# Altium project VOU_SOM_CV_V0.0.1.PrjPcb (part 3 of 3)

## Sheet Conn_B.SchDoc
size A1
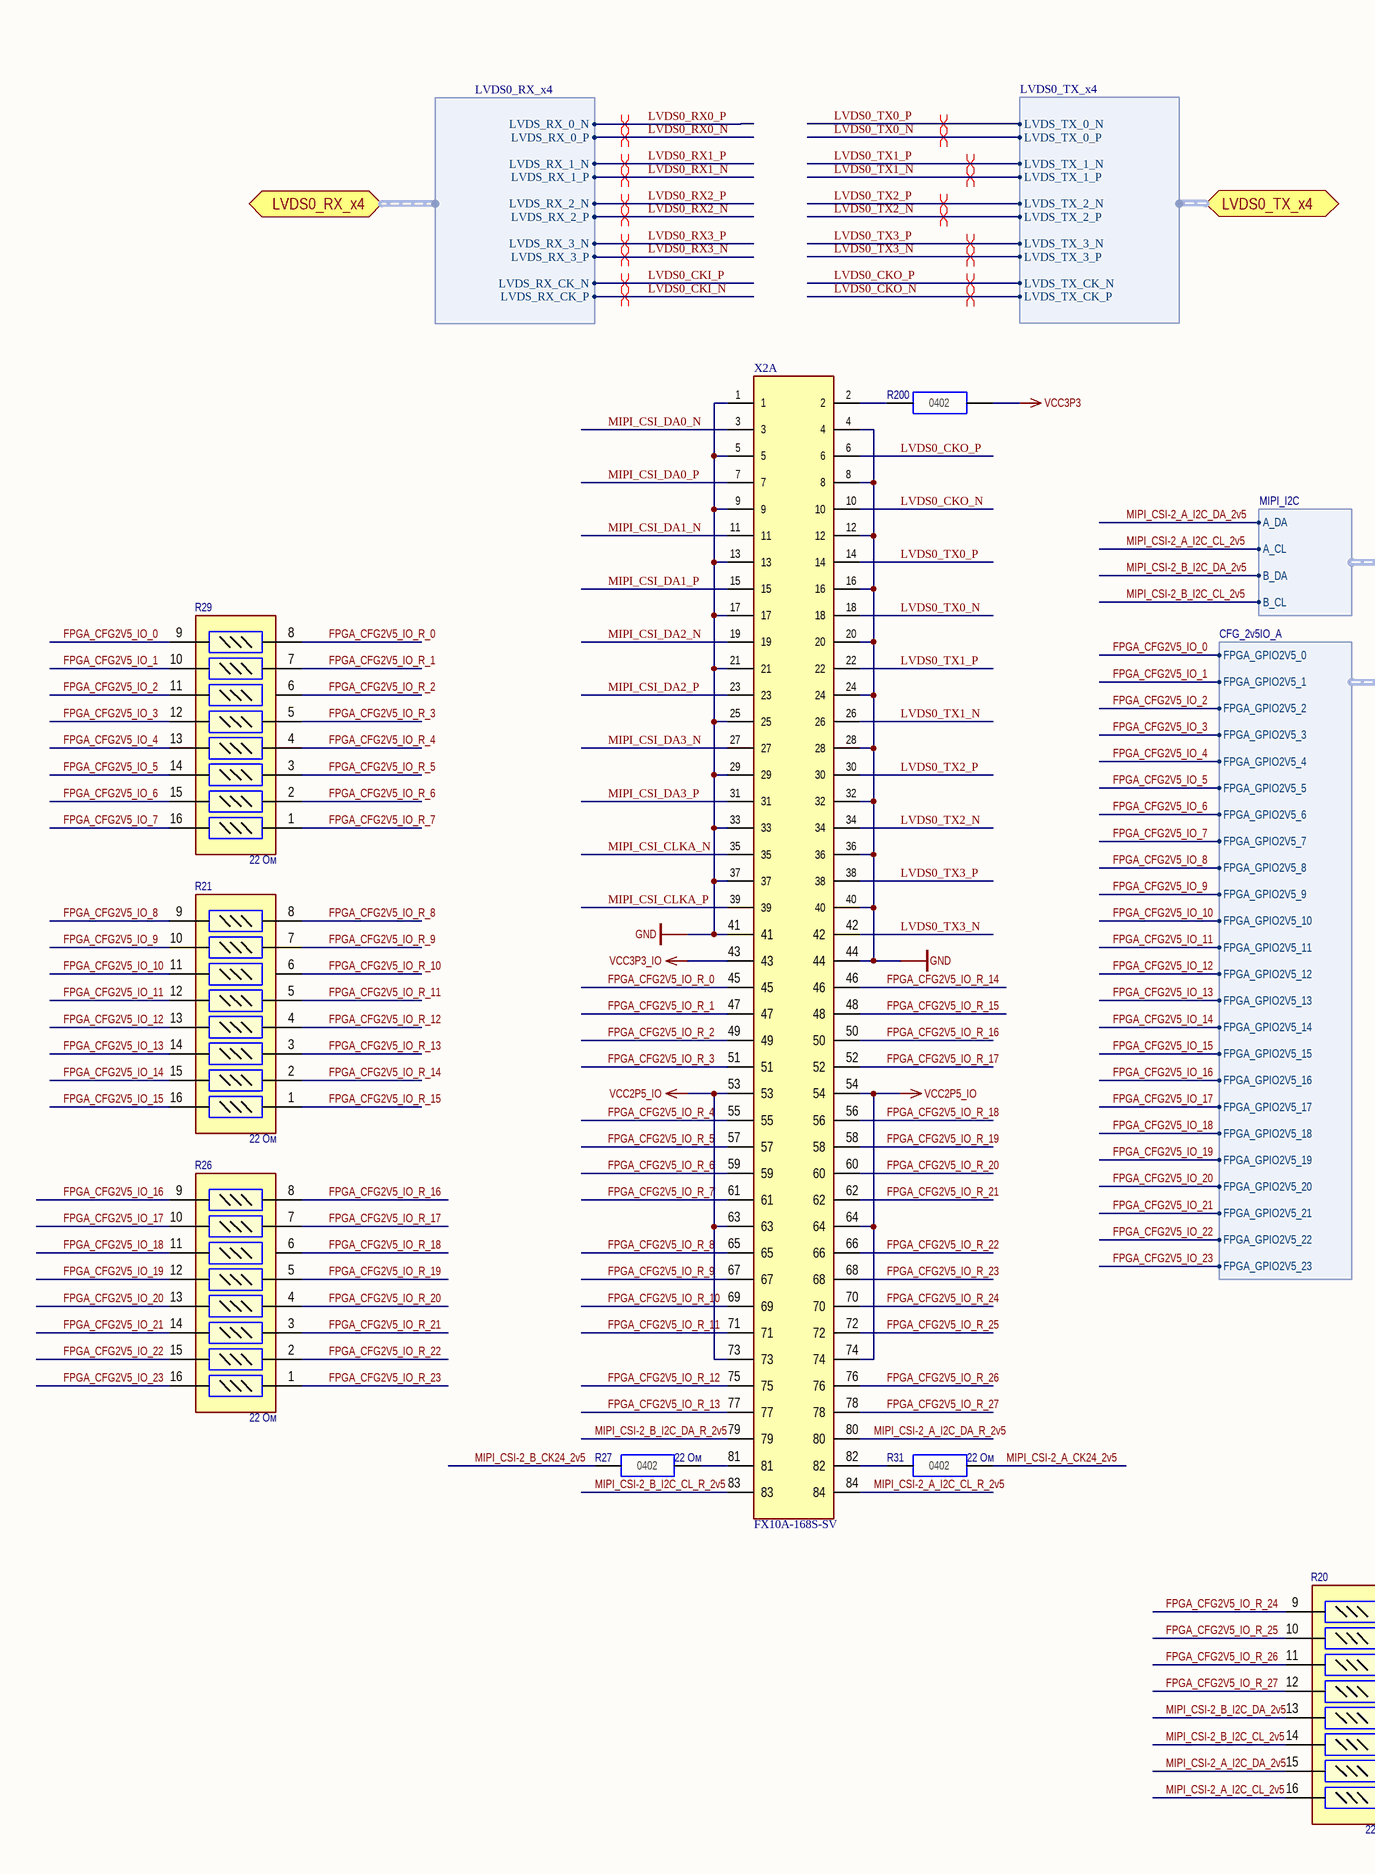
[diagram p15: Conn_B.SchDoc, left]
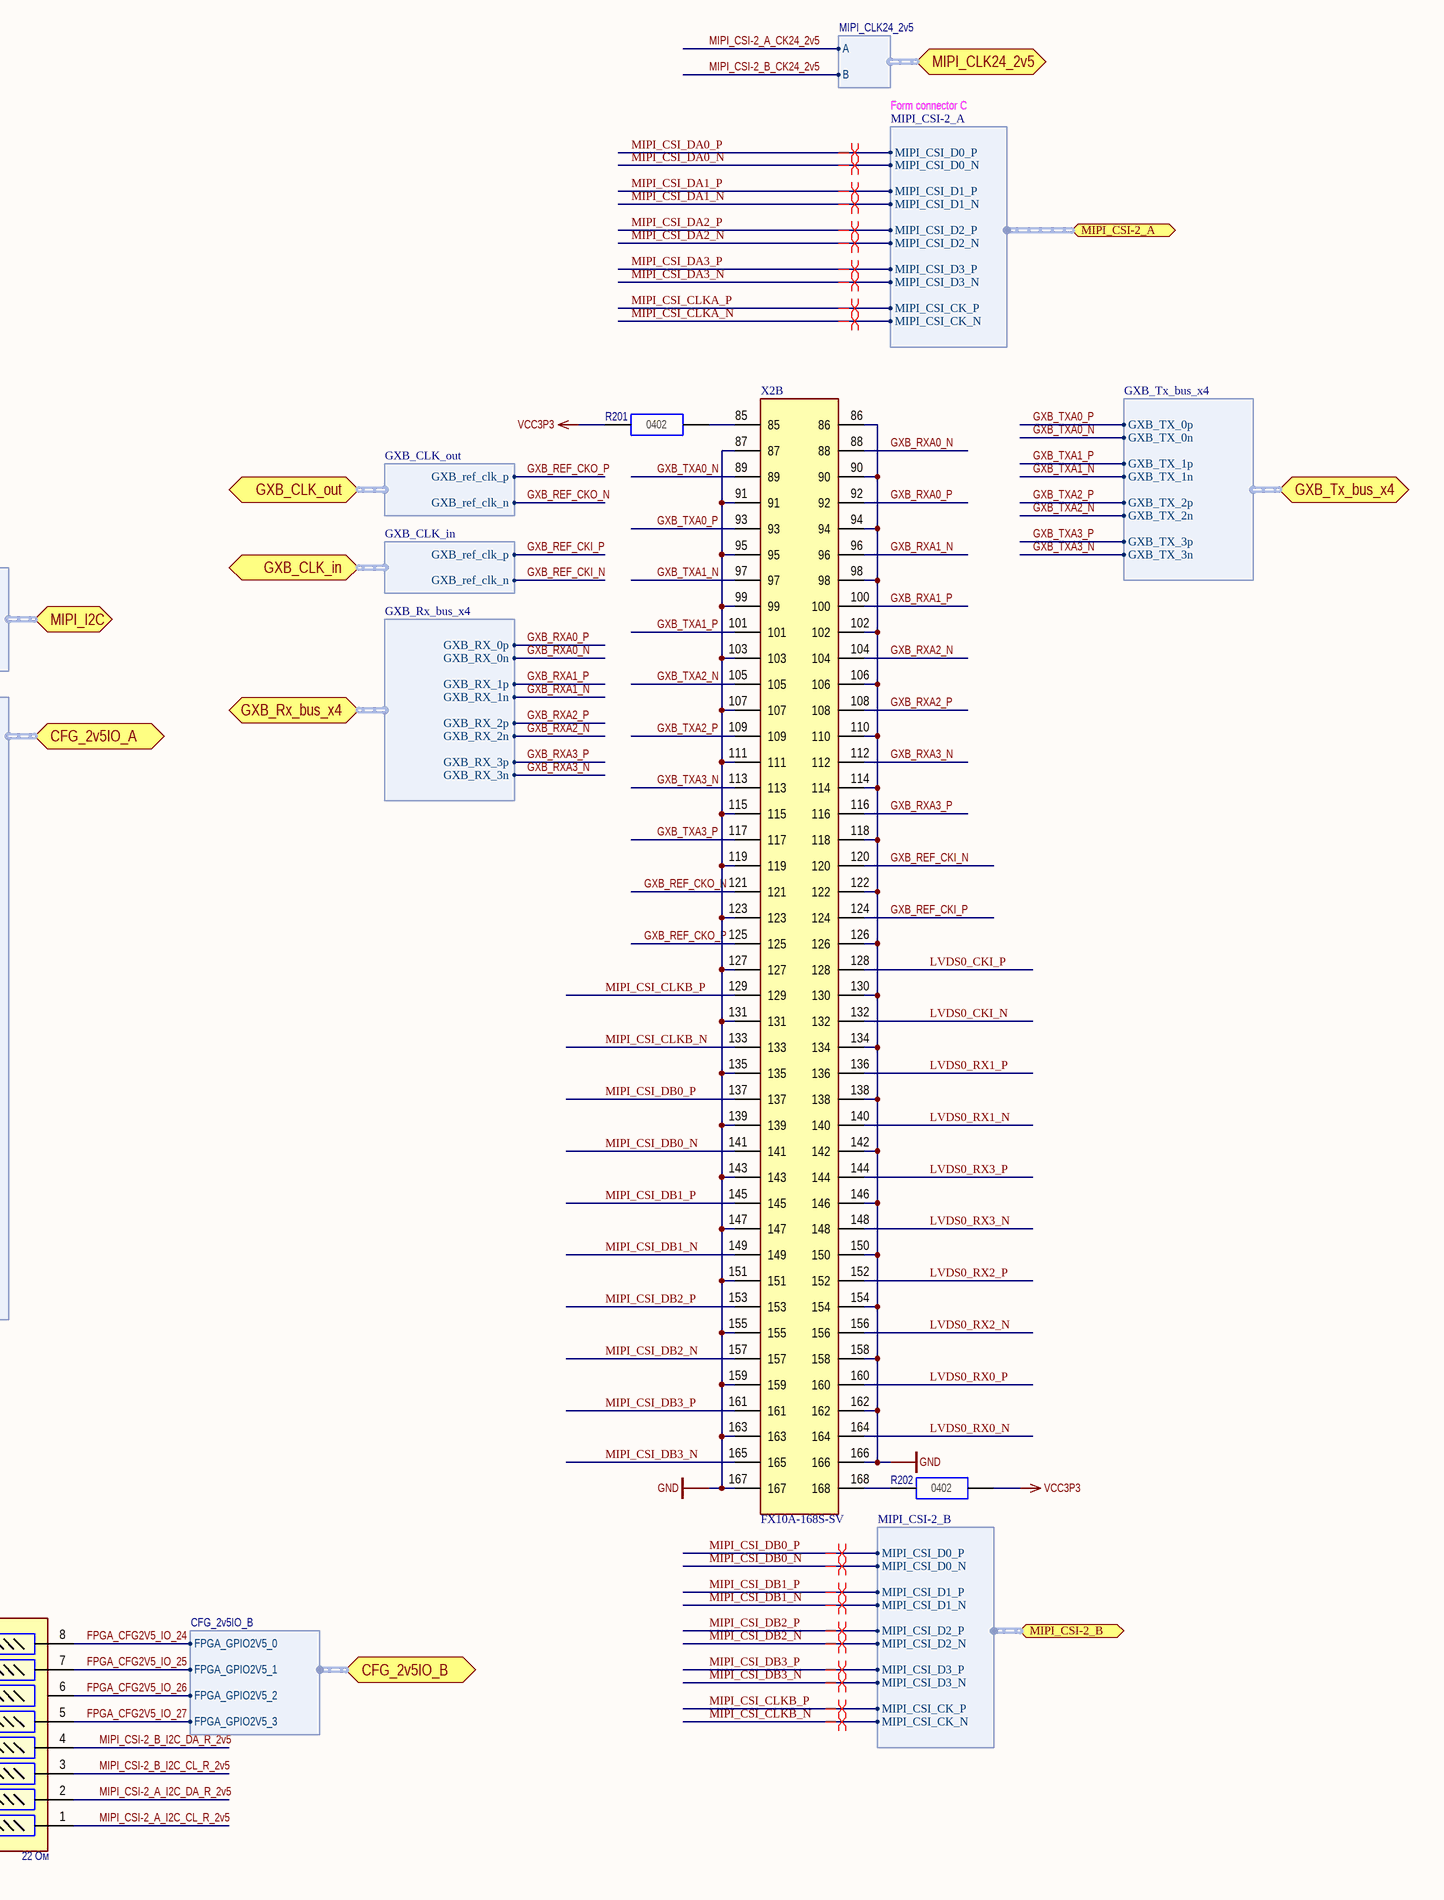
[diagram p16: Conn_B.SchDoc, right]

### Parts
R20  value 22 Ом  [YC248]  (hidden comment: YC248-JR-07-22 Ом)
R21  value 22 Ом  [YC248]  (hidden comment: YC248-JR-07-22 Ом)
R26  value 22 Ом  [YC248]  (hidden comment: YC248-JR-07-22 Ом)
R27  value 22 Ом  [CR0402(1005)]  (hidden comment: CR0402-22 Ом-±5%)
R29  value 22 Ом  [YC248]  (hidden comment: YC248-JR-07-22 Ом)
R31  value 22 Ом  [CR0402(1005)]  (hidden comment: CR0402-22 Ом-±5%)
R200  CR0402-0 Ом-±5%  [CR0402(1005)]  (value not drawn)
R201  CR0402-0 Ом-±5%  [CR0402(1005)]  (value not drawn)
R202  CR0402-0 Ом-±5%  [CR0402(1005)]  (value not drawn)
X2  FX10A-168S-SV  [FX10A-168S-SV]  (parts A,B of 2)

### Ports
CFG_2v5IO_A (harness CFG_2v5IO_A), CFG_2v5IO_B (harness CFG_2v5IO_B), GXB_CLK_in (harness GXB_CLK_in), GXB_CLK_out (harness GXB_CLK_out), GXB_Rx_bus_x4 (harness GXB_Rx_bus_x4), GXB_Tx_bus_x4 (harness GXB_Tx_bus_x4), LVDS0_RX_x4 (harness LVDS0_RX_x4), LVDS0_TX_x4 (harness LVDS0_TX_x4), MIPI_CLK24_2v5 (harness MIPI_CLK24_2v5), MIPI_CSI-2_A (harness MIPI_CSI-2_A), MIPI_CSI-2_B (harness MIPI_CSI-2_B), MIPI_I2C (harness MIPI_I2C)

### Harnesses
MIPI_CSI-2_A: MIPI_CSI_D0_N, MIPI_CSI_D0_P, MIPI_CSI_D1_N, MIPI_CSI_D1_P, MIPI_CSI_D2_P, MIPI_CSI_D2_N, MIPI_CSI_D3_N, MIPI_CSI_D3_P, MIPI_CSI_CK_N, MIPI_CSI_CK_P
MIPI_CSI-2_B: MIPI_CSI_D0_N, MIPI_CSI_D0_P, MIPI_CSI_D1_N, MIPI_CSI_D1_P, MIPI_CSI_D2_P, MIPI_CSI_D2_N, MIPI_CSI_D3_N, MIPI_CSI_D3_P, MIPI_CSI_CK_N, MIPI_CSI_CK_P
MIPI_CLK24_2v5: A, B
MIPI_I2C: A_DA, A_CL, B_DA, B_CL
CFG_2v5IO_A: FPGA_GPIO2V5_0, FPGA_GPIO2V5_1, FPGA_GPIO2V5_2, FPGA_GPIO2V5_3, FPGA_GPIO2V5_4, FPGA_GPIO2V5_5, FPGA_GPIO2V5_6, FPGA_GPIO2V5_7, FPGA_GPIO2V5_8, FPGA_GPIO2V5_9, FPGA_GPIO2V5_10, FPGA_GPIO2V5_11, FPGA_GPIO2V5_12, FPGA_GPIO2V5_13, FPGA_GPIO2V5_14, FPGA_GPIO2V5_15, FPGA_GPIO2V5_16, FPGA_GPIO2V5_17, FPGA_GPIO2V5_18, FPGA_GPIO2V5_19, FPGA_GPIO2V5_20, FPGA_GPIO2V5_21, FPGA_GPIO2V5_22, FPGA_GPIO2V5_23
CFG_2v5IO_B: FPGA_GPIO2V5_0, FPGA_GPIO2V5_1, FPGA_GPIO2V5_2, FPGA_GPIO2V5_3
GXB_Rx_bus_x4: GXB_RX_0p, GXB_RX_0n, GXB_RX_1p, GXB_RX_1n, GXB_RX_2p, GXB_RX_2n, GXB_RX_3p, GXB_RX_3n
GXB_Tx_bus_x4: GXB_TX_0p, GXB_TX_0n, GXB_TX_1p, GXB_TX_1n, GXB_TX_2p, GXB_TX_2n, GXB_TX_3p, GXB_TX_3n
GXB_CLK_out: GXB_ref_clk_p, GXB_ref_clk_n
GXB_CLK_in: GXB_ref_clk_p, GXB_ref_clk_n
LVDS0_TX_x4: LVDS_TX_0_P, LVDS_TX_0_N, LVDS_TX_1_P, LVDS_TX_1_N, LVDS_TX_2_P, LVDS_TX_2_N, LVDS_TX_3_P, LVDS_TX_3_N, LVDS_TX_CK_P, LVDS_TX_CK_N
LVDS0_RX_x4: LVDS_RX_0_P, LVDS_RX_0_N, LVDS_RX_1_P, LVDS_RX_1_N, LVDS_RX_2_P, LVDS_RX_2_N, LVDS_RX_3_P, LVDS_RX_3_N, LVDS_RX_CK_P, LVDS_RX_CK_N

### Nets
GND: X2.1 X2.4 X2.5 X2.8 X2.9 X2.12 X2.13 X2.16 X2.17 X2.20 X2.21 X2.24 X2.25 X2.28 X2.29 X2.32 X2.33 X2.36 X2.37 X2.40 X2.41 X2.44 X2.86 X2.87 X2.90 X2.91 X2.94 X2.95 X2.98 X2.99 X2.102 X2.103 X2.106 X2.107 X2.110 X2.111 X2.114 X2.115 X2.118 X2.119 X2.122 X2.123 X2.126 X2.127 X2.130 X2.131 X2.134 X2.135 X2.138 X2.139 X2.142 X2.143 X2.146 X2.147 X2.150 X2.151 X2.154 X2.155 X2.158 X2.159 X2.162 X2.163 X2.166 X2.167
VCC2P5_IO: X2.53 X2.54 X2.63 X2.64 X2.73 X2.74
VCC3P3: R200.2(-) R201.1(+) R202.2(-)
VCC3P3_IO: X2.43
FPGA_CFG2V5_IO_0: R29.9 ; port CFG_2v5IO_A.FPGA_GPIO2V5_0
FPGA_CFG2V5_IO_1: R29.10 ; port CFG_2v5IO_A.FPGA_GPIO2V5_1
FPGA_CFG2V5_IO_2: R29.11 ; port CFG_2v5IO_A.FPGA_GPIO2V5_2
FPGA_CFG2V5_IO_3: R29.12 ; port CFG_2v5IO_A.FPGA_GPIO2V5_3
FPGA_CFG2V5_IO_4: R29.13 ; port CFG_2v5IO_A.FPGA_GPIO2V5_4
FPGA_CFG2V5_IO_5: R29.14 ; port CFG_2v5IO_A.FPGA_GPIO2V5_5
FPGA_CFG2V5_IO_6: R29.15 ; port CFG_2v5IO_A.FPGA_GPIO2V5_6
FPGA_CFG2V5_IO_7: R29.16 ; port CFG_2v5IO_A.FPGA_GPIO2V5_7
FPGA_CFG2V5_IO_8: R21.9 ; port CFG_2v5IO_A.FPGA_GPIO2V5_8
FPGA_CFG2V5_IO_9: R21.10 ; port CFG_2v5IO_A.FPGA_GPIO2V5_9
FPGA_CFG2V5_IO_10: R21.11 ; port CFG_2v5IO_A.FPGA_GPIO2V5_10
FPGA_CFG2V5_IO_11: R21.12 ; port CFG_2v5IO_A.FPGA_GPIO2V5_11
FPGA_CFG2V5_IO_12: R21.13 ; port CFG_2v5IO_A.FPGA_GPIO2V5_12
FPGA_CFG2V5_IO_13: R21.14 ; port CFG_2v5IO_A.FPGA_GPIO2V5_13
FPGA_CFG2V5_IO_14: R21.15 ; port CFG_2v5IO_A.FPGA_GPIO2V5_14
FPGA_CFG2V5_IO_15: R21.16 ; port CFG_2v5IO_A.FPGA_GPIO2V5_15
FPGA_CFG2V5_IO_16: R26.9 ; port CFG_2v5IO_A.FPGA_GPIO2V5_16
FPGA_CFG2V5_IO_17: R26.10 ; port CFG_2v5IO_A.FPGA_GPIO2V5_17
FPGA_CFG2V5_IO_18: R26.11 ; port CFG_2v5IO_A.FPGA_GPIO2V5_18
FPGA_CFG2V5_IO_19: R26.12 ; port CFG_2v5IO_A.FPGA_GPIO2V5_19
FPGA_CFG2V5_IO_20: R26.13 ; port CFG_2v5IO_A.FPGA_GPIO2V5_20
FPGA_CFG2V5_IO_21: R26.14 ; port CFG_2v5IO_A.FPGA_GPIO2V5_21
FPGA_CFG2V5_IO_22: R26.15 ; port CFG_2v5IO_A.FPGA_GPIO2V5_22
FPGA_CFG2V5_IO_23: R26.16 ; port CFG_2v5IO_A.FPGA_GPIO2V5_23
FPGA_CFG2V5_IO_24: R20.8 ; port CFG_2v5IO_B.FPGA_GPIO2V5_0
FPGA_CFG2V5_IO_25: R20.7 ; port CFG_2v5IO_B.FPGA_GPIO2V5_1
FPGA_CFG2V5_IO_26: R20.6 ; port CFG_2v5IO_B.FPGA_GPIO2V5_2
FPGA_CFG2V5_IO_27: R20.5 ; port CFG_2v5IO_B.FPGA_GPIO2V5_3
FPGA_CFG2V5_IO_R_0: R29.8 X2.45
FPGA_CFG2V5_IO_R_1: R29.7 X2.47
FPGA_CFG2V5_IO_R_2: R29.6 X2.49
FPGA_CFG2V5_IO_R_3: R29.5 X2.51
FPGA_CFG2V5_IO_R_4: R29.4 X2.55
FPGA_CFG2V5_IO_R_5: R29.3 X2.57
FPGA_CFG2V5_IO_R_6: R29.2 X2.59
FPGA_CFG2V5_IO_R_7: R29.1 X2.61
FPGA_CFG2V5_IO_R_8: R21.8 X2.65
FPGA_CFG2V5_IO_R_9: R21.7 X2.67
FPGA_CFG2V5_IO_R_10: R21.6 X2.69
FPGA_CFG2V5_IO_R_11: R21.5 X2.71
FPGA_CFG2V5_IO_R_12: R21.4 X2.75
FPGA_CFG2V5_IO_R_13: R21.3 X2.77
FPGA_CFG2V5_IO_R_14: R21.2 X2.46
FPGA_CFG2V5_IO_R_15: R21.1 X2.48
FPGA_CFG2V5_IO_R_16: R26.8 X2.50
FPGA_CFG2V5_IO_R_17: R26.7 X2.52
FPGA_CFG2V5_IO_R_18: R26.6 X2.56
FPGA_CFG2V5_IO_R_19: R26.5 X2.58
FPGA_CFG2V5_IO_R_20: R26.4 X2.60
FPGA_CFG2V5_IO_R_21: R26.3 X2.62
FPGA_CFG2V5_IO_R_22: R26.2 X2.66
FPGA_CFG2V5_IO_R_23: R26.1 X2.68
FPGA_CFG2V5_IO_R_24: R20.9 X2.70
FPGA_CFG2V5_IO_R_25: R20.10 X2.72
FPGA_CFG2V5_IO_R_26: R20.11 X2.76
FPGA_CFG2V5_IO_R_27: R20.12 X2.78
GXB_REF_CKI_N: X2.120 ; port GXB_CLK_in.GXB_ref_clk_n
GXB_REF_CKI_P: X2.124 ; port GXB_CLK_in.GXB_ref_clk_p
GXB_REF_CKO_N: X2.121 ; port GXB_CLK_out.GXB_ref_clk_n
GXB_REF_CKO_P: X2.125 ; port GXB_CLK_out.GXB_ref_clk_p
GXB_RXA0_N: X2.88 ; port GXB_Rx_bus_x4.GXB_RX_0n
GXB_RXA0_P: X2.92 ; port GXB_Rx_bus_x4.GXB_RX_0p
GXB_RXA1_N: X2.96 ; port GXB_Rx_bus_x4.GXB_RX_1n
GXB_RXA1_P: X2.100 ; port GXB_Rx_bus_x4.GXB_RX_1p
GXB_RXA2_N: X2.104 ; port GXB_Rx_bus_x4.GXB_RX_2n
GXB_RXA2_P: X2.108 ; port GXB_Rx_bus_x4.GXB_RX_2p
GXB_RXA3_N: X2.112 ; port GXB_Rx_bus_x4.GXB_RX_3n
GXB_RXA3_P: X2.116 ; port GXB_Rx_bus_x4.GXB_RX_3p
GXB_TXA0_N: X2.89 ; port GXB_Tx_bus_x4.GXB_TX_0n
GXB_TXA0_P: X2.93 ; port GXB_Tx_bus_x4.GXB_TX_0p
GXB_TXA1_N: X2.97 ; port GXB_Tx_bus_x4.GXB_TX_1n
GXB_TXA1_P: X2.101 ; port GXB_Tx_bus_x4.GXB_TX_1p
GXB_TXA2_N: X2.105 ; port GXB_Tx_bus_x4.GXB_TX_2n
GXB_TXA2_P: X2.109 ; port GXB_Tx_bus_x4.GXB_TX_2p
GXB_TXA3_N: X2.113 ; port GXB_Tx_bus_x4.GXB_TX_3n
GXB_TXA3_P: X2.117 ; port GXB_Tx_bus_x4.GXB_TX_3p
LVDS0_CKI_N: X2.132 ; port LVDS0_RX_x4.LVDS_RX_CK_P
LVDS0_CKI_P: X2.128 ; port LVDS0_RX_x4.LVDS_RX_CK_N
LVDS0_CKO_N: X2.10 ; port LVDS0_TX_x4.LVDS_TX_CK_P
LVDS0_CKO_P: X2.6 ; port LVDS0_TX_x4.LVDS_TX_CK_N
LVDS0_RX0_N: X2.164 ; port LVDS0_RX_x4.LVDS_RX_0_P
LVDS0_RX0_P: X2.160 ; port LVDS0_RX_x4.LVDS_RX_0_N
LVDS0_RX1_N: X2.140 ; port LVDS0_RX_x4.LVDS_RX_1_P
LVDS0_RX1_P: X2.136 ; port LVDS0_RX_x4.LVDS_RX_1_N
LVDS0_RX2_N: X2.156 ; port LVDS0_RX_x4.LVDS_RX_2_P
LVDS0_RX2_P: X2.152 ; port LVDS0_RX_x4.LVDS_RX_2_N
LVDS0_RX3_N: X2.148 ; port LVDS0_RX_x4.LVDS_RX_3_P
LVDS0_RX3_P: X2.144 ; port LVDS0_RX_x4.LVDS_RX_3_N
LVDS0_TX0_N: X2.18 ; port LVDS0_TX_x4.LVDS_TX_0_P
LVDS0_TX0_P: X2.14 ; port LVDS0_TX_x4.LVDS_TX_0_N
LVDS0_TX1_N: X2.26 ; port LVDS0_TX_x4.LVDS_TX_1_P
LVDS0_TX1_P: X2.22 ; port LVDS0_TX_x4.LVDS_TX_1_N
LVDS0_TX2_N: X2.34 ; port LVDS0_TX_x4.LVDS_TX_2_P
LVDS0_TX2_P: X2.30 ; port LVDS0_TX_x4.LVDS_TX_2_N
LVDS0_TX3_N: X2.42 ; port LVDS0_TX_x4.LVDS_TX_3_P
LVDS0_TX3_P: X2.38 ; port LVDS0_TX_x4.LVDS_TX_3_N
MIPI_CSI-2_A_CK24_2v5: R31.2(-) ; port MIPI_CLK24_2v5.A
MIPI_CSI-2_A_I2C_CL_2v5: R20.16 ; port MIPI_I2C.A_CL
MIPI_CSI-2_A_I2C_CL_R_2v5: R20.1 X2.84
MIPI_CSI-2_A_I2C_DA_2v5: R20.15 ; port MIPI_I2C.A_DA
MIPI_CSI-2_A_I2C_DA_R_2v5: R20.2 X2.80
MIPI_CSI-2_B_CK24_2v5: R27.1(+) ; port MIPI_CLK24_2v5.B
MIPI_CSI-2_B_I2C_CL_2v5: R20.14 ; port MIPI_I2C.B_CL
MIPI_CSI-2_B_I2C_CL_R_2v5: R20.3 X2.83
MIPI_CSI-2_B_I2C_DA_2v5: R20.13 ; port MIPI_I2C.B_DA
MIPI_CSI-2_B_I2C_DA_R_2v5: R20.4 X2.79
MIPI_CSI_CLKA_N: X2.35 ; port MIPI_CSI-2_A.MIPI_CSI_CK_N
MIPI_CSI_CLKA_P: X2.39 ; port MIPI_CSI-2_A.MIPI_CSI_CK_P
MIPI_CSI_CLKB_N: X2.133 ; port MIPI_CSI-2_B.MIPI_CSI_CK_N
MIPI_CSI_CLKB_P: X2.129 ; port MIPI_CSI-2_B.MIPI_CSI_CK_P
MIPI_CSI_DA0_N: X2.3 ; port MIPI_CSI-2_A.MIPI_CSI_D0_N
MIPI_CSI_DA0_P: X2.7 ; port MIPI_CSI-2_A.MIPI_CSI_D0_P
MIPI_CSI_DA1_N: X2.11 ; port MIPI_CSI-2_A.MIPI_CSI_D1_N
MIPI_CSI_DA1_P: X2.15 ; port MIPI_CSI-2_A.MIPI_CSI_D1_P
MIPI_CSI_DA2_N: X2.19 ; port MIPI_CSI-2_A.MIPI_CSI_D2_N
MIPI_CSI_DA2_P: X2.23 ; port MIPI_CSI-2_A.MIPI_CSI_D2_P
MIPI_CSI_DA3_N: X2.27 ; port MIPI_CSI-2_A.MIPI_CSI_D3_N
MIPI_CSI_DA3_P: X2.31 ; port MIPI_CSI-2_A.MIPI_CSI_D3_P
MIPI_CSI_DB0_N: X2.141 ; port MIPI_CSI-2_B.MIPI_CSI_D0_N
MIPI_CSI_DB0_P: X2.137 ; port MIPI_CSI-2_B.MIPI_CSI_D0_P
MIPI_CSI_DB1_N: X2.149 ; port MIPI_CSI-2_B.MIPI_CSI_D1_N
MIPI_CSI_DB1_P: X2.145 ; port MIPI_CSI-2_B.MIPI_CSI_D1_P
MIPI_CSI_DB2_N: X2.157 ; port MIPI_CSI-2_B.MIPI_CSI_D2_N
MIPI_CSI_DB2_P: X2.153 ; port MIPI_CSI-2_B.MIPI_CSI_D2_P
MIPI_CSI_DB3_N: X2.165 ; port MIPI_CSI-2_B.MIPI_CSI_D3_N
MIPI_CSI_DB3_P: X2.161 ; port MIPI_CSI-2_B.MIPI_CSI_D3_P
NetR27_2: R27.2(-) X2.81
NetR31_1: R31.1(+) X2.82
NetR200_1: R200.1(+) X2.2
NetR201_2: R201.2(-) X2.85
NetR202_1: R202.1(+) X2.168

### Layout directives
differential pair: LVDS0_CKI_N, LVDS0_CKI_P, LVDS0_CKO_N, LVDS0_CKO_P, LVDS0_RX0_N, LVDS0_RX0_P, LVDS0_RX1_N, LVDS0_RX1_P, LVDS0_RX2_N, LVDS0_RX2_P, LVDS0_RX3_N, LVDS0_RX3_P, LVDS0_TX0_N, LVDS0_TX0_P, LVDS0_TX1_N, LVDS0_TX1_P, LVDS0_TX2_N, LVDS0_TX2_P, LVDS0_TX3_N, LVDS0_TX3_P, MIPI_CSI_CLKA_N, MIPI_CSI_CLKA_P, MIPI_CSI_CLKB_N, MIPI_CSI_CLKB_P, MIPI_CSI_DA0_N, MIPI_CSI_DA0_P, MIPI_CSI_DA1_N, MIPI_CSI_DA1_P, MIPI_CSI_DA2_N, MIPI_CSI_DA2_P, MIPI_CSI_DA3_N, MIPI_CSI_DA3_P, MIPI_CSI_DB0_N, MIPI_CSI_DB0_P, MIPI_CSI_DB1_N, MIPI_CSI_DB1_P, MIPI_CSI_DB2_N, MIPI_CSI_DB2_P, MIPI_CSI_DB3_N, MIPI_CSI_DB3_P

### Notes on the sheet
- Form connector C
- (in symbol CR0402-#-±5%) 0402

### Library data of the parts
R20 R21 R26 R29 = YC248-JR-07-#: Набор чип резисторов; P: 0.062 Вт; Supplier 1: Digi-Key; Supplier Part Number 1: YC248-JR-0722RL
R27 R31 = CR0402-#-±5%: as R78-R117 on sheet MIPI_CSI-2; Supplier 1: Digi-Key; Supplier Part Number 1: 311-10.0KLRDKR-ND
R200-R202 = CR0402-#-±5%: Чип резистор; Maximum Working Voltage: 50 В; TOLERANCE: 5%; VALUE: 0 Ом; Supplier 1: Digi-Key; Supplier Part Number 1: 311-10.0KLRDKR-ND

## Sheet CLK_src&sys_logic.SchDoc
size A2
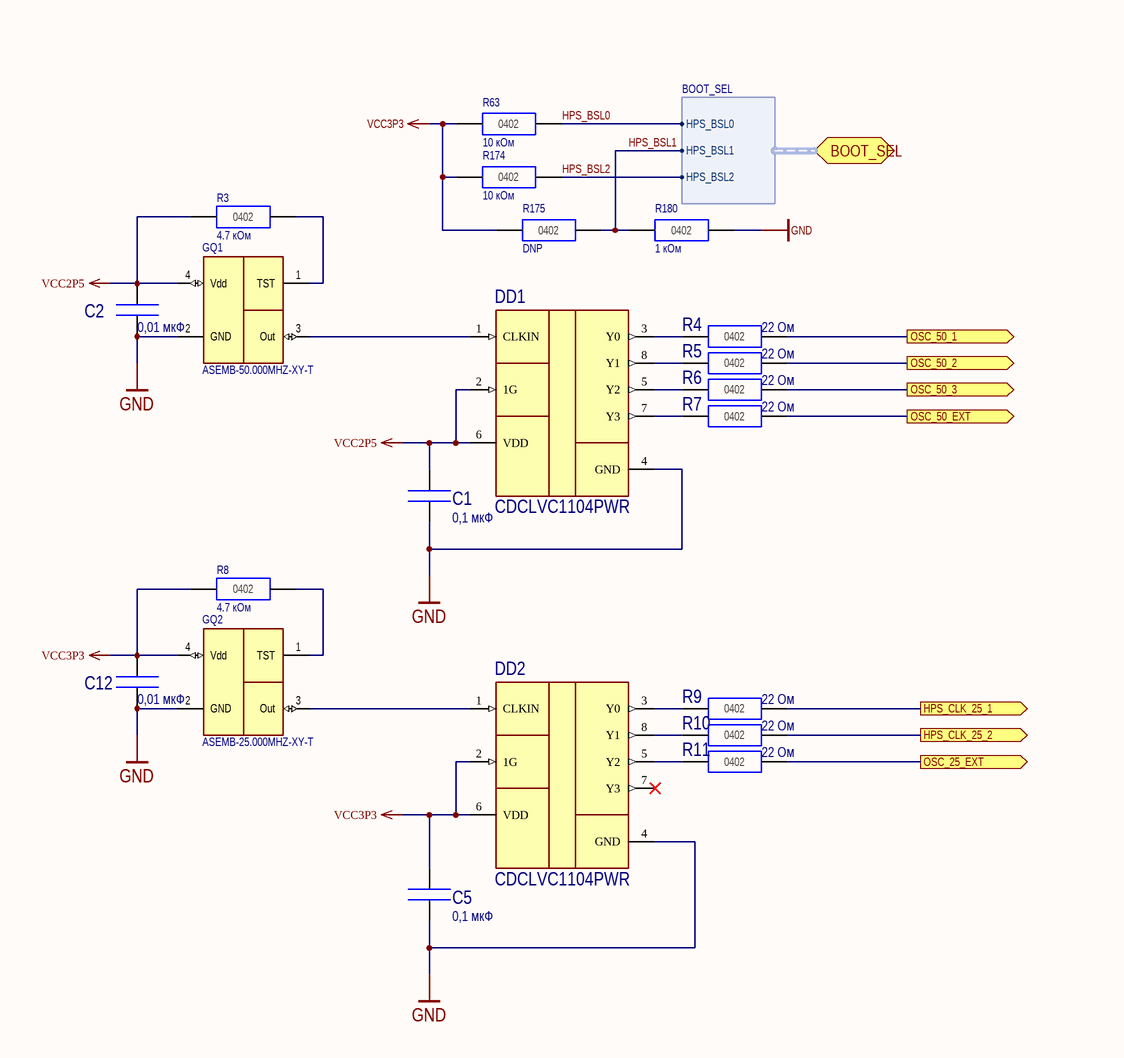
[diagram p17: CLK_src&sys_logic.SchDoc, left]
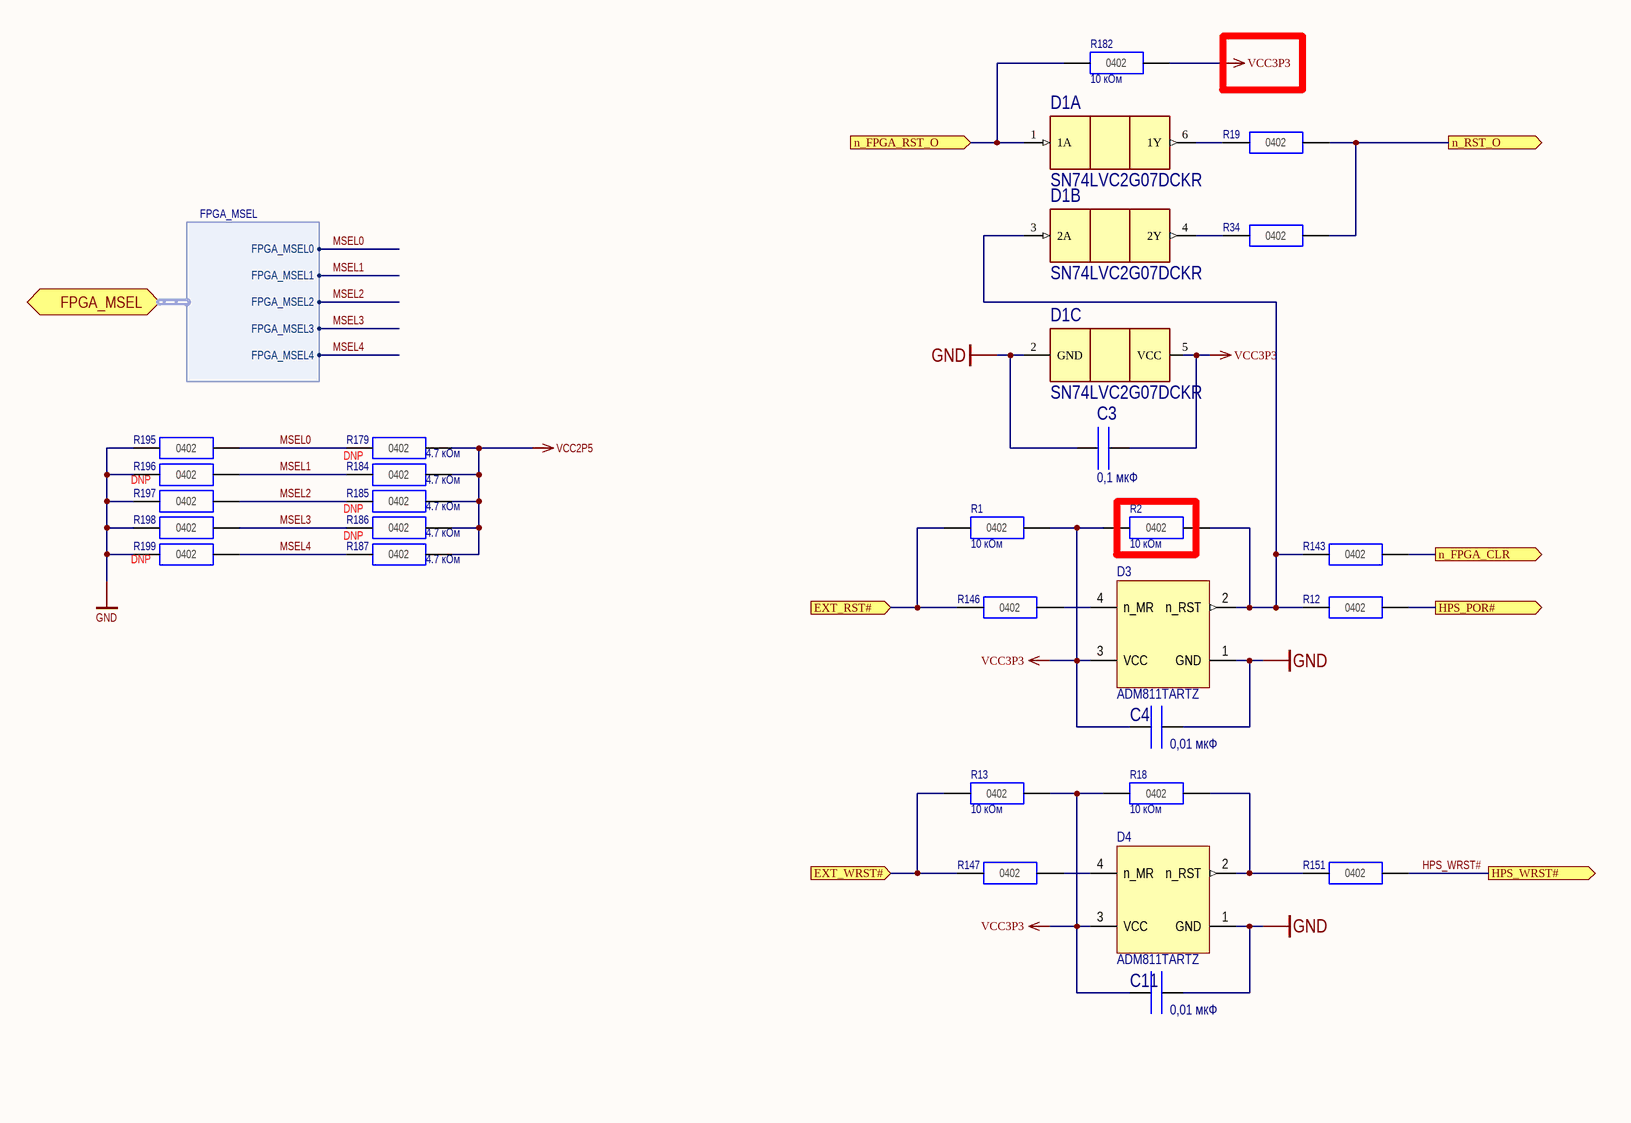
[diagram p18: CLK_src&sys_logic.SchDoc, right]

### Parts
C1  value 0,1 мкФ  [CC0402(1005)]  (hidden comment: CC0402-X7R-0,1 мкФ-20%-10В)
C2  value 0,01 мкФ  [CC0402(1005)]  (hidden comment: CC0402-X7R-0,01 мкФ-10%-50В)
C3  value 0,1 мкФ  [CC0402(1005)]  (hidden comment: CC0402-X7R-0,1 мкФ-20%-10В)
C4  value 0,01 мкФ  [CC0402(1005)]  (hidden comment: CC0402-X7R-0,01 мкФ-10%-50В)
C5  value 0,1 мкФ  [CC0402(1005)]  (hidden comment: CC0402-X7R-0,1 мкФ-20%-10В)
C11  value 0,01 мкФ  [CC0402(1005)]  (hidden comment: CC0402-X7R-0,01 мкФ-10%-50В)
C12  value 0,01 мкФ  [CC0402(1005)]  (hidden comment: CC0402-X7R-0,01 мкФ-10%-50В)
D1  SN74LVC2G07DCKR  [DCKR]  (parts A,B,C of 3)
D3  ADM811TARTZ  [SOT-143]
D4  ADM811TARTZ  [SOT-143]
DD1  CDCLVC1104PWR  [TSSOP-8]
DD2  CDCLVC1104PWR  [TSSOP-8]
GQ1  ASEMB-50.000MHZ-XY-T  [DFN210P320X100-4N]
GQ2  ASEMB-25.000MHZ-XY-T  [DFN210P320X100-4N]
R1  value 10 кОм  [CR0402(1005)]  (hidden comment: CR0402-10 кОм-±5%)
R2  value 10 кОм  [CR0402(1005)]  (hidden comment: CR0402-10 кОм-±5%)
R3  value 4.7 кОм  [CR0402(1005)]  (hidden comment: CR0402-4.7 кОм-±5%)
R4  value 22 Ом  [CR0402(1005)]  (hidden comment: CR0402-22 Ом-±5%)
R5  value 22 Ом  [CR0402(1005)]  (hidden comment: CR0402-22 Ом-±5%)
R6  value 22 Ом  [CR0402(1005)]  (hidden comment: CR0402-22 Ом-±5%)
R7  value 22 Ом  [CR0402(1005)]  (hidden comment: CR0402-22 Ом-±5%)
R8  value 4.7 кОм  [CR0402(1005)]  (hidden comment: CR0402-4.7 кОм-±5%)
R9  value 22 Ом  [CR0402(1005)]  (hidden comment: CR0402-22 Ом-±5%)
R10  value 22 Ом  [CR0402(1005)]  (hidden comment: CR0402-22 Ом-±5%)
R11  value 22 Ом  [CR0402(1005)]  (hidden comment: CR0402-22 Ом-±5%)
R12  CR0402-0 Ом-±5%  [CR0402(1005)]  (value not drawn)
R13  value 10 кОм  [CR0402(1005)]  (hidden comment: CR0402-10 кОм-±5%)
R18  value 10 кОм  [CR0402(1005)]  (hidden comment: CR0402-10 кОм-±5%)
R19  CR0402-0 Ом-±5%  [CR0402(1005)]  (value not drawn)
R34  CR0402-0 Ом-±5%  [CR0402(1005)]  (value not drawn)
R63  value 10 кОм  [CR0402(1005)_OCT]  (hidden comment: CR0402-10 кОм-±5%)
R143  CR0402-0 Ом-±5%  [CR0402(1005)]  (value not drawn)
R146  CR0402-0 Ом-±5%  [CR0402(1005)]  (value not drawn)
R147  CR0402-0 Ом-±5%  [CR0402(1005)]  (value not drawn)
R151  CR0402-0 Ом-±5%  [CR0402(1005)]  (value not drawn)
R174  value 10 кОм  [CR0402(1005)_OCT]  (hidden comment: CR0402-10 кОм-±5%)
R175  value DNP  [CR0402(1005)]  (hidden comment: CR0402-DNP-±5%)
R179  value 4.7 кОм  Place: DNP  [CR0402(1005)_OCT]  (hidden comment: CR0402-4.7 кОм-±5%)
R180  value 1 кОм  [CR0402(1005)]  (hidden comment: CR0402-1 кОм-±5%)
R182  value 10 кОм  [CR0402(1005)]  (hidden comment: CR0402-10 кОм-±5%)
R184  value 4.7 кОм  [CR0402(1005)_OCT]  (hidden comment: CR0402-4.7 кОм-±5%)
R185  value 4.7 кОм  Place: DNP  [CR0402(1005)]  (hidden comment: CR0402-4.7 кОм-±5%)
R186  value 4.7 кОм  Place: DNP  [CR0402(1005)]  (hidden comment: CR0402-4.7 кОм-±5%)
R187  value 4.7 кОм  [CR0402(1005)]  (hidden comment: CR0402-4.7 кОм-±5%)
R195  CR0402-0 Ом-±5%  [CR0402(1005)]  (value not drawn)
R196  Place: DNP  [CR0402(1005)]  (hidden comment: CR0402-0 Ом-±5%)
R197  CR0402-0 Ом-±5%  [CR0402(1005)]  (value not drawn)
R198  CR0402-0 Ом-±5%  [CR0402(1005)]  (value not drawn)
R199  Place: DNP  [CR0402(1005)]  (hidden comment: CR0402-0 Ом-±5%)

### Ports
BOOT_SEL (harness BOOT_SEL), EXT_RST# (in), EXT_WRST# (in), FPGA_MSEL (harness FPGA_MSEL), HPS_CLK_25_1 (out), HPS_CLK_25_2 (out), HPS_POR# (out), HPS_WRST# (out), n_FPGA_CLR (out), n_FPGA_RST_O (in), n_RST_O (out), OSC_25_EXT (out), OSC_50_1 (out), OSC_50_2 (out), OSC_50_3 (out), OSC_50_EXT (out)

### Harnesses
FPGA_MSEL: FPGA_MSEL0, FPGA_MSEL1, FPGA_MSEL2, FPGA_MSEL3, FPGA_MSEL4
BOOT_SEL: HPS_BSL0, HPS_BSL1, HPS_BSL2

### Nets
GND: C1.2(-) C2.1(+) C3.1(+) C4.1(+) C5.2(-) C11.1(+) C12.1(+) D1.2(GND) D3.1(GND) D4.1(GND) DD1.4(GND) DD2.4(GND) GQ1.2(GND) GQ2.2(GND) R180.2(-) R195.1(+) R196.1(+) R197.1(+) R198.1(+) R199.1(+)
VCC2P5: C1.1(+) C2.2(-) DD1.2(1G) DD1.6(VDD) GQ1.4(Vdd) R3.1(+) R179.2(-) R184.2(-) R185.2(-) R186.2(-) R187.2(-)
VCC3P3: C3.2(-) C4.2(-) C5.1(+) C11.2(-) C12.2(-) D1.5(VCC) D3.3(VCC) D4.3(VCC) DD2.2(1G) DD2.6(VDD) GQ2.4(Vdd) R1.2(-) R2.1(+) R8.1(+) R13.2(-) R18.1(+) R63.1(+) R174.1(+) R175.1(+) R182.2(-)
HPS_BSL0: R63.2(-) ; port BOOT_SEL.HPS_BSL0
HPS_BSL1: R175.2(-) R180.1(+) ; port BOOT_SEL.HPS_BSL1
HPS_BSL2: R174.2(-) ; port BOOT_SEL.HPS_BSL2
HPS_WRST#: R151.2(-) ; port HPS_WRST#
MSEL0: R179.1(+) R195.2(-) ; port FPGA_MSEL.FPGA_MSEL0
MSEL1: R184.1(+) R196.2(-) ; port FPGA_MSEL.FPGA_MSEL1
MSEL2: R185.1(+) R197.2(-) ; port FPGA_MSEL.FPGA_MSEL2
MSEL3: R186.1(+) R198.2(-) ; port FPGA_MSEL.FPGA_MSEL3
MSEL4: R187.1(+) R199.2(-) ; port FPGA_MSEL.FPGA_MSEL4
NetD1_1: D1.1(1A) R182.1(+) ; port n_FPGA_RST_O
NetD1_3: D1.3(2A) D3.2(n_RST) R2.2(-) R12.1(+) R143.1(+)
NetD1_4: D1.4(2Y) R34.1(+)
NetD1_6: D1.6(1Y) R19.1(+)
NetD3_4: D3.4(n_MR) R146.2(-)
NetD4_2: D4.2(n_RST) R18.2(-) R151.1(+)
NetD4_4: D4.4(n_MR) R147.2(-)
NetDD1_1: DD1.1(CLKIN) GQ1.3(Out)
NetDD1_3: DD1.3(Y0) R4.1(+)
NetDD1_5: DD1.5(Y2) R6.1(+)
NetDD1_7: DD1.7(Y3) R7.1(+)
NetDD1_8: DD1.8(Y1) R5.1(+)
NetDD2_1: DD2.1(CLKIN) GQ2.3(Out)
NetDD2_3: DD2.3(Y0) R9.1(+)
NetDD2_5: DD2.5(Y2) R11.1(+)
NetDD2_8: DD2.8(Y1) R10.1(+)
NetGQ1_1: GQ1.1(TST) R3.2(-)
NetGQ2_1: GQ2.1(TST) R8.2(-)
NetR1_1: R1.1(+) R146.1(+) ; port EXT_RST#
NetR4_2: R4.2(-) ; port OSC_50_1
NetR5_2: R5.2(-) ; port OSC_50_2
NetR6_2: R6.2(-) ; port OSC_50_3
NetR7_2: R7.2(-) ; port OSC_50_EXT
NetR9_2: R9.2(-) ; port HPS_CLK_25_1
NetR10_2: R10.2(-) ; port HPS_CLK_25_2
NetR11_2: R11.2(-) ; port OSC_25_EXT
NetR12_2: R12.2(-) ; port HPS_POR#
NetR13_1: R13.1(+) R147.1(+) ; port EXT_WRST#
NetR19_2: R19.2(-) R34.2(-) ; port n_RST_O
NetR143_2: R143.2(-) ; port n_FPGA_CLR

Not connected (* = marked no-connect by the designer): DD2 7(Y3)*

### Notes on the sheet
- (in symbol CR0402-#-±5%) 0402

### Library data of the parts
C1-C5 C11 C12 = CC0402-X7R-#-20%-10В: Чип конденсатор керамический; Supplier 1: Digi-Key
  C1 C3 C5: Supplier Part Number 1: 399-3520-1-ND
  C2 C4 C11 C12: Supplier Part Number 1: 490-4516-2-ND
D1 = IC_TI_SN74LVC2G07: Dual Buffer and Driver With Open-Drain Outputs; Supplier 1: Digi-Key; Supplier Part Number 1: 296-13495-2-ND
D3 D4 = IC_AD_ADM811TARTZ: Microprocessor Supervisory Circuit in 3-Pin SOT-23; LatestRevisionNote: Re-released for DXP Platform.; DatasheetVersion: REV.H 2016; Publisher: Altium Limited; PackageDescription: SOT-143; 4 Leads; Body 3.0 x 2.6 mm, inc. leads (LxW max); ComponentLink1Description: Manufacturer Link; ComponentLink1URL: http://www.analog.com/en/products/power-management/supervisory/simple-reset-supervisory-ic/adm811.html?doc=adm811_812.pdf; ComponentLink2Description: Datasheet; ComponentLink2URL: http://www.analog.com/en/products/power-management/supervisory/simple-reset-supervisory-ic/adm811.html?doc=adm811_812.pdf#product-overview
DD1 DD2 = CDCLVC1104PWR: High-Performance  Clock Buffer 1:4; Supplier 1: Digi-Key; Supplier Part Number 1: 296-27549-1-ND
GQ1 GQ2 = OSC-ABRCN-ASE3: Dual High Side Switch With OC_DET 500mA/CH; Manufacturer Name: Abracon LLC
  GQ1: Manufacturer Part No.: ASEMB-50.000MHZ-XY-T
  GQ2: Manufacturer Part No.: ASEMB-25.000MHZ-XY-T
R1-R11 R13 R18 R63 R174 R175 R179 R180 R182 R184-R187 = CR0402-#-±5%: as R78-R117 on sheet MIPI_CSI-2; Supplier 1: Digi-Key
  R1 R2 R13 R18 R63 R174 R175 R182: Supplier Part Number 1: 311-10.0KJRTR-ND
  R3 R8 R179 R184-R187: Supplier Part Number 1: 311-4.7KJRTR-ND
  R4-R7 R9-R11: Supplier Part Number 1: 311-10.0KLRDKR-ND
  R180: Supplier Part Number 1: 311-1.0KJRTR-ND
R12 R19 R34 R143 R146 R147 R151 R195-R199 = CR0402-#-±5%: as R200 on sheet Conn_B; Supplier 1: Digi-Key; Supplier Part Number 1: 311-10.0KLRDKR-ND

## Nets that join several sheets
DDR3_VREF_FPGA: FPGA_DDR3&IO (6 pins), SoC_pwr_1 (C167.1 D2.AJ15 D2.AK17)
DDR3_VREF_HPS: HPS_DDR3 (6 pins), SoC_pwr_1 (D2.G27 D2.U30)
GND: FPGA_DDR3&IO (72 pins), HPS_DDR3 (68 pins), SoC_pwr_1 (382 pins), MIPI_CSI-2 (10 pins), Conn_A (37 pins), Conn_B (64 pins), CLK_src&sys_logic (20 pins)
VCC1P5_DDR3: FPGA_DDR3&IO (40 pins), HPS_DDR3 (40 pins), SoC_pwr_1 (75 pins)
VCC2P5: SoC_pwr_1 (73 pins), CLK_src&sys_logic (11 pins)
VCC2P5_IO: Conn_A (8 pins), Conn_B (6 pins)
VCC3P3: FPGA_DDR3&IO (C16.1 D5.10 R55.1 R56.1), HPS_DDR3 (C47.1 D8.10 R73.1 R74.1), SoC_pwr_1 (29 pins), Conn_B (R200.2 R201.1 R202.2), CLK_src&sys_logic (20 pins)
VCC3P3_IO: Conn_A (8 pins), Conn_B (X2.43)
VCC_BAT: SoC_pwr_1 (C188.1 D2.H9), Conn_A (X1.111)

## Assembly variants
NO MEMORY NO SDRAM NO BLUETOOTH DIMS_DSP_V4.1.1: not fitted DA1 DD4 MP1 XP2 XS1
FULL COMPLECT DIMS_DSP_V4.1.1: not fitted XP2 XS1